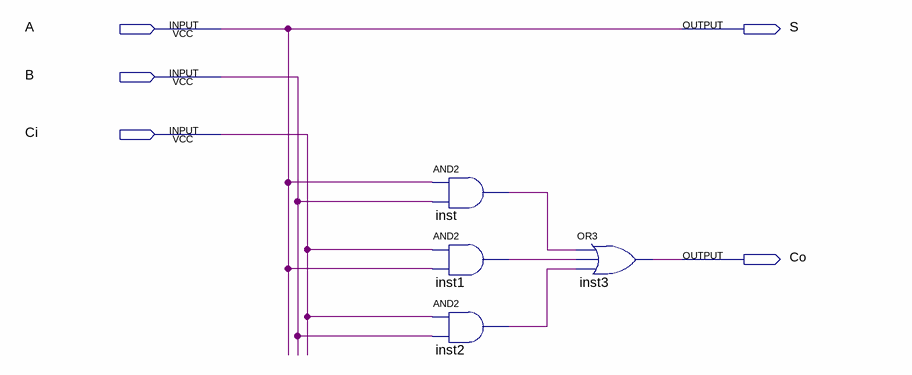
[diagram p0: schematic sheet]
// Quartus schematic fulladder_1b.bdf as structural Verilog: 4 symbols, 5 pins
module fulladder_1b (
  input  A,
  input  B,
  input  Ci,
  output S,
  output Co
);

  wire inst1_out, inst2_out, inst_out;

  and inst (inst_out, A, B);
  and inst1 (inst1_out, Ci, A);
  and inst2 (inst2_out, Ci, B);
  or inst3 (Co, inst_out, inst1_out, inst2_out);

  assign S = A;
endmodule
